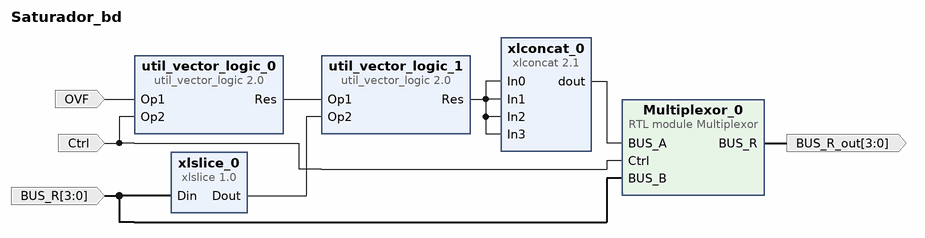
[diagram p0: block diagram of the top level]
# Vivado block design Saturador_bd, xc7a35ticpg236-1L, Vivado 2023.2
create_bd_design Saturador_bd

create_bd_port -dir I OVF
create_bd_port -dir I Ctrl
create_bd_port -dir I -from 3 -to 0 BUS_R
create_bd_port -dir O -from 3 -to 0 BUS_R_out

create_bd_cell -type ip -vlnv xilinx.com:ip:util_vector_logic:2.0 util_vector_logic_0
set_property -dict {CONFIG.C_SIZE 1} [get_bd_cells util_vector_logic_0]
create_bd_cell -type ip -vlnv xilinx.com:ip:util_vector_logic:2.0 util_vector_logic_1
set_property -dict {CONFIG.C_SIZE 1} [get_bd_cells util_vector_logic_1]
create_bd_cell -type ip -vlnv xilinx.com:ip:xlslice:1.0 xlslice_0
set_property -dict {CONFIG.DIN_FROM 3 CONFIG.DIN_TO 3 CONFIG.DIN_WIDTH 4} [get_bd_cells xlslice_0]
create_bd_cell -type ip -vlnv xilinx.com:ip:xlconcat:2.1 xlconcat_0
set_property -dict {CONFIG.NUM_PORTS 4} [get_bd_cells xlconcat_0]
create_bd_cell -type module -reference Multiplexor Multiplexor_0

# ---- connections ----

connect_bd_net [get_bd_ports BUS_R] [get_bd_pins xlslice_0/Din] [get_bd_pins Multiplexor_0/BUS_B]
connect_bd_net [get_bd_ports Ctrl] [get_bd_pins util_vector_logic_0/Op2] [get_bd_pins Multiplexor_0/Ctrl]
connect_bd_net [get_bd_pins Multiplexor_0/BUS_R] [get_bd_ports BUS_R_out]
connect_bd_net [get_bd_ports OVF] [get_bd_pins util_vector_logic_0/Op1]
connect_bd_net [get_bd_pins util_vector_logic_0/Res] [get_bd_pins util_vector_logic_1/Op1]
connect_bd_net [get_bd_pins util_vector_logic_1/Res] \
  [get_bd_pins xlconcat_0/In0] [get_bd_pins xlconcat_0/In2] [get_bd_pins xlconcat_0/In1] [get_bd_pins xlconcat_0/In3]
connect_bd_net [get_bd_pins xlconcat_0/dout] [get_bd_pins Multiplexor_0/BUS_A]
connect_bd_net [get_bd_pins xlslice_0/Dout] [get_bd_pins util_vector_logic_1/Op2]

validate_bd_design
save_bd_design
